# Altium schematic sheet Glasses-PSUBoard.SchDoc
size A3
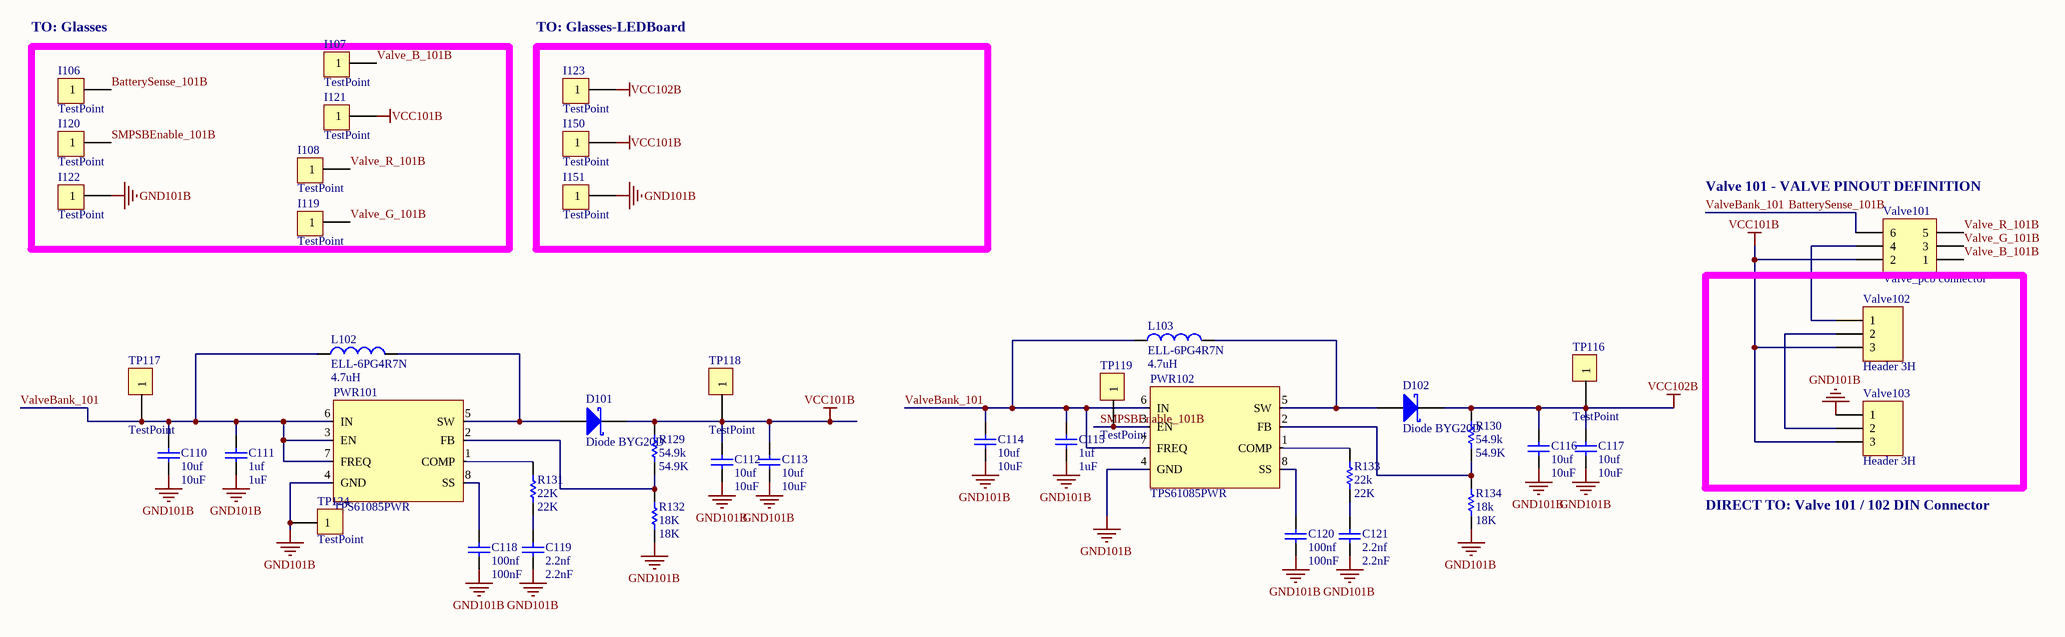
[diagram p0: Glasses-PSUBoard.SchDoc]

## Parts
C110  10uf  [0805]
C111  1uf  [0603]
C112  10uf  [0805]
C113  10uf  [0805]
C114  10uf  [0805]
C115  1uf  [0603]
C116  10uf  [0805]
C117  10uf  [0805]
C118  100nf  [0603]
C119  2.2nf  [0603]
C120  100nf  [0603]
C121  2.2nf  [0603]
D101  Diode BYG20D  [BYG20J-E3]
D102  Diode BYG20D  [BYG20J-E3]
I106  TestPoint  [TestPoint]
I107  TestPoint  [TestPoint]
I108  TestPoint  [TestPoint]
I119  TestPoint  [TestPoint]
I120  TestPoint  [TestPoint]
I121  TestPoint  [TestPoint]
I122  TestPoint  [TestPoint]
I123  TestPoint  [TestPoint]
I150  TestPoint  [TestPoint]
I151  TestPoint  [TestPoint]
L102  ELL-6PG4R7N  value 4.7uH  [ELL6PG4R7N-2CHK]
L103  ELL-6PG4R7N  value 4.7uH  [ELL6PG4R7N-2CHK]
PWR101  TPS61085PWR  [TPS61085-MSOP8]
PWR102  TPS61085PWR  [TPS61085-MSOP8]
R129  54.9k  [0603]
R130  54.9k  [0603]
R131  22K  [0603]
R132  18K  [0603]
R133  22k  [0603]
R134  18k  [0603]
TP116  TestPoint  [TestPoint]
TP117  TestPoint  [TestPoint]
TP118  TestPoint  [TestPoint]
TP119  TestPoint  [TestPoint]
TP124  TestPoint  [TestPoint]
Valve101  Valve_pcb connector  [Valve_pcb mount]
Valve102  Header 3H  [Valve_3 pin]
Valve103  Header 3H  [Valve_3 pin]

## Blocks framed on the sheet
TO: Glasses: I106-I108 I119-I122
TO: Glasses-LEDBoard: I123 I150 I151

## Nets
GND101B: C110.1 C111.1 C112.1 C113.1 C114.1 C115.1 C116.1 C117.1 C118.1 C119.1 C120.1 C121.1 I122.1 I151.1 PWR101.4(GND) PWR102.4(GND) R132.1 R134.1 TP124.1 Valve103.1
VCC101B: C112.2 C113.2 D101.1(K) I121.1 I150.1 R129.2 TP118.1 Valve101.2 Valve102.3 Valve103.3
VCC102B: C116.2 C117.2 D102.1(K) I123.1 R130.2 TP116.1
BatterySense_101B: C110.2 C111.2 C114.2 C115.2 I106.1 L102.1 L103.1 PWR101.3(EN) PWR101.6(IN) PWR101.7(FREQ) PWR102.6(IN) PWR102.7(FREQ) TP117.1 Valve101.6  [also labelled ValveBank_101]
SMPSBEnable_101B: I120.1 PWR102.3(EN) TP119.1
Valve_B_101B: I107.1 Valve101.1
Valve_G_101B: I119.1 Valve101.3
Valve_R_101B: I108.1 Valve101.5
NetC118_2: C118.2 PWR101.8(SS)
NetC119_2: C119.2 R131.1
NetC120_2: C120.2 PWR102.8(SS)
NetC121_2: C121.2 R133.1
NetD101_3: D101.3(A) L102.2 PWR101.5(SW)
NetD102_3: D102.3(A) L103.2 PWR102.5(SW)
NetPWR101_1: PWR101.1(COMP) R131.2
NetPWR101_2: PWR101.2(FB) R129.1 R132.2
NetPWR102_1: PWR102.1(COMP) R133.2
NetPWR102_2: PWR102.2(FB) R130.1 R134.2
NetValve101_4: Valve101.4 Valve102.1
NetValve102_2: Valve102.2 Valve103.2

## Notes on the sheet
- (near Valve101) Valve 101 - VALVE PINOUT DEFINITION
- DIRECT TO: Valve 101 / 102 DIN Connector

## Library data of the parts
C110-C121 = Cap Semi: Capacitor (Semiconductor SIM Model); Published: 8-Jun-2000; LatestRevisionDate: 29-May-2009; LatestRevisionNote: IPC-7351 Footprint Added.; PackageReference: C1206; Publisher: Altium Limited; PackageDescription: Chip Capacitor
  C110 C112-C114 C116 C117: Value: 10uF
  C111 C115: Value: 1uF
  C118 C120: Value: 100nF
  C119 C121: Value: 2.2nF
D101 D102 = Diode 10TQ035: Schottky Rectifier; Note: Terminal 2 is the TAB and is electrically connected to the cathode; Published: 8-Jun-2000; LatestRevisionDate: 17-Jul-2002; LatestRevisionNote: Re-released for DXP Platform.; DatasheetVersion: PD-2.057B; PackageVersion: Feb-1998; PackageReference: TO-220AC; Publisher: Altium Limited; ComponentLink1Description: Manufacturer Link; ComponentLink1URL: http://www.irf.com/; ComponentLink2Description: Datasheet; ComponentLink2URL: http://www.irf.com/product-info/datasheets/data/10tq.pdf
L102 L103 = Inductor: Code_IEC: 1005; Published: 8-Jun-2000; LatestRevisionDate: 29-May-2009; LatestRevisionNote: IPC-7351 Footprint Added.; PackageReference: 0402-A; Publisher: Altium Limited; PackageDescription: Chip Inductor; Code_JEITA: 0402
R129-R134 = Res1: Resistor; Published: 8-Jun-2000; LatestRevisionDate: 17-Jul-2002; LatestRevisionNote: Re-released for DXP Platform.; PackageReference: AXIAL-0.3; Publisher: Altium Limited
  R129 R130: Value: 54.9K
  R131 R133: Value: 22K
  R132 R134: Value: 18K
Valve101 = Header 3X2H: Header, 3-Pin, Dual row, Right Angle; LatestRevisionDate: 17-Jul-2002; LatestRevisionNote: Re-released for DXP Platform.; Publisher: Altium Limited
Valve102 Valve103 = Header 3H: Header, 3-Pin, Right Angle; LatestRevisionDate: 17-Jul-2002; LatestRevisionNote: Re-released for DXP Platform.; Publisher: Altium Limited